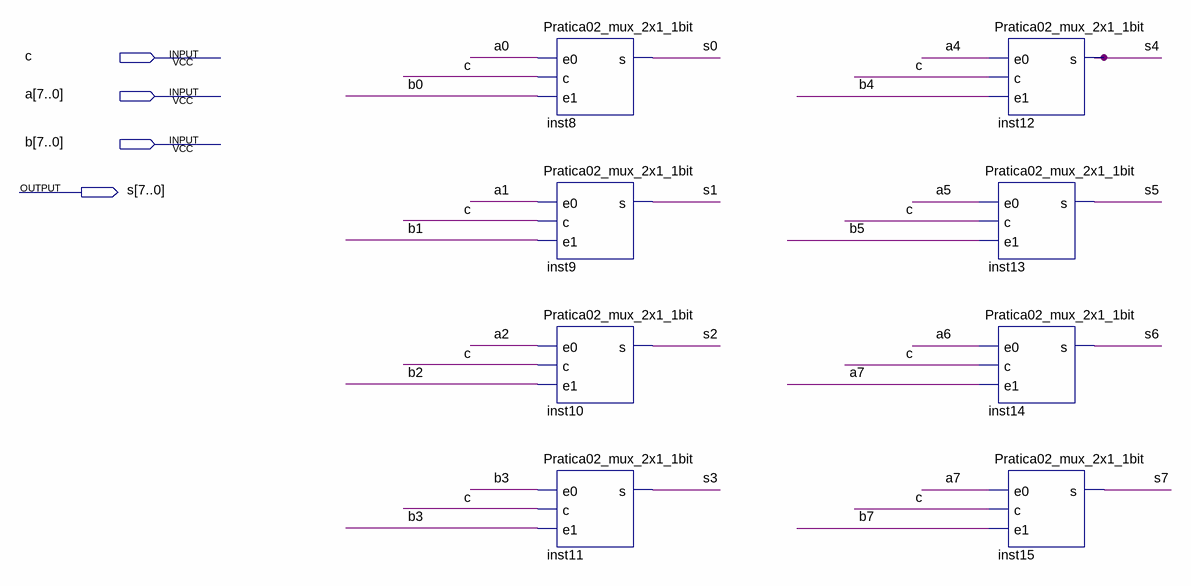
[diagram p0: schematic sheet]
// Quartus schematic Pratica02_mux_2x1_8bits.bdf as structural Verilog: 8 symbols, 4 pins
module Pratica02_mux_2x1_8bits (
  input  c,
  input  [7:0] a,
  input  [7:0] b,
  output [7:0] s
);

  Pratica02_mux_2x1_1bit inst8 (.e0(a[0]), .c(c), .e1(b[0]), .s(s[0]));
  Pratica02_mux_2x1_1bit inst9 (.e0(a[1]), .c(c), .e1(b[1]), .s(s[1]));
  Pratica02_mux_2x1_1bit inst10 (.e0(a[2]), .c(c), .e1(b[2]), .s(s[2]));
  Pratica02_mux_2x1_1bit inst11 (.e0(b[3]), .c(c), .e1(b[3]), .s(s[3]));
  Pratica02_mux_2x1_1bit inst12 (.e0(a[4]), .c(c), .e1(b[4]), .s(s[4]));
  Pratica02_mux_2x1_1bit inst13 (.e0(a[5]), .c(c), .e1(b[5]), .s(s[5]));
  Pratica02_mux_2x1_1bit inst14 (.e0(a[6]), .c(c), .e1(a[7]), .s(s[6]));
  Pratica02_mux_2x1_1bit inst15 (.e0(a[7]), .c(c), .e1(b[7]), .s(s[7]));
endmodule
